# Altium schematic sheet config-bank7.SchDoc: Config FPGA - Bank 7
size Letter; CheckedBy: E. Chiu; CompanyName: Brinton Engineering, LLC; DrawnBy: J. Brinton; Engineer: J. Brinton; Address1: 3479 Edison Way; Address2: Menlo Park CA 94025; Address3: +1 (877) 778-8435; Address4: brintonengineering.com; Revision: 1; SheetNumber: 24; SheetTotal: 71
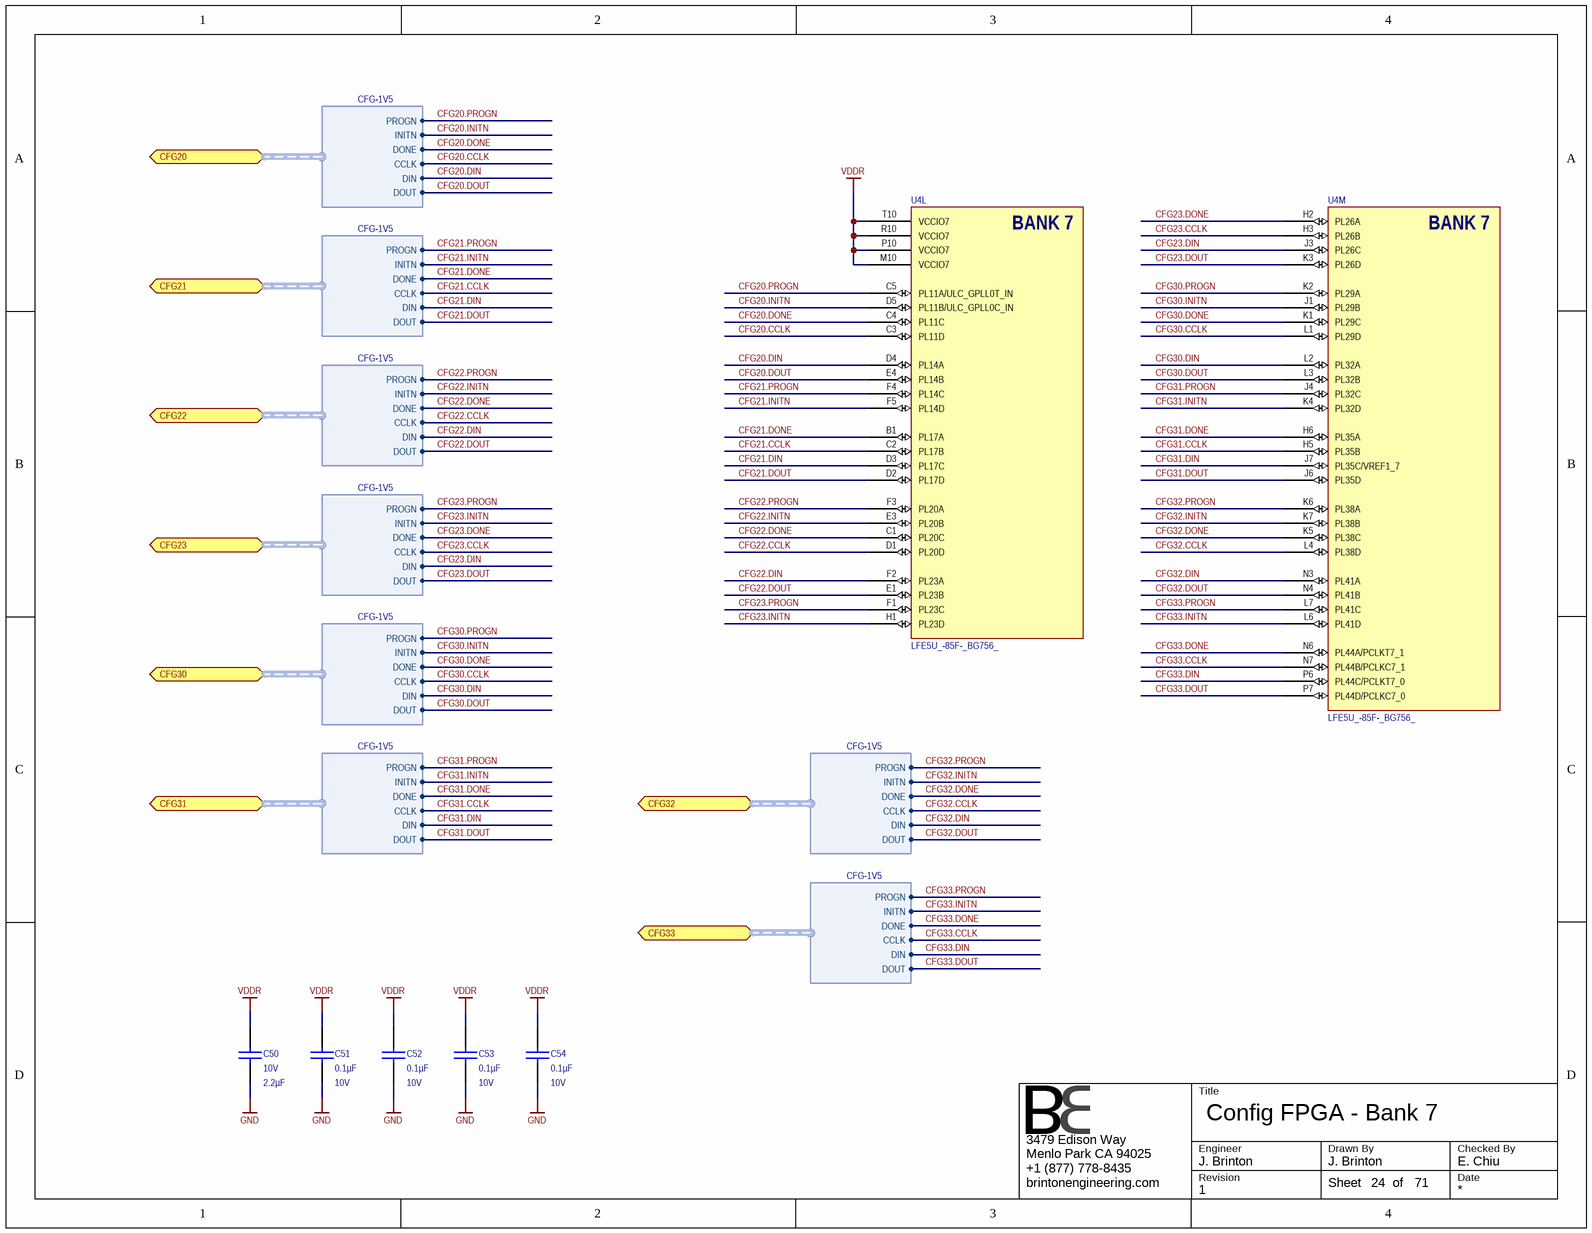
[diagram p0: config-bank7.SchDoc]

## Parts
C50  Voltage - Rated: 10V  Capacitance: 2.2µF  [CAPC1608X90N]  (hidden comment: GRM188R71A225KE15D)
C51  Capacitance: 0.1µF  Voltage - Rated: 10V  [CAPC1005X56N]  (hidden comment: GRM155R71A104KA01J)
C52  Capacitance: 0.1µF  Voltage - Rated: 10V  [CAPC1005X56N]  (hidden comment: GRM155R71A104KA01J)
C53  Capacitance: 0.1µF  Voltage - Rated: 10V  [CAPC1005X56N]  (hidden comment: GRM155R71A104KA01J)
C54  Capacitance: 0.1µF  Voltage - Rated: 10V  [CAPC1005X56N]  (hidden comment: GRM155R71A104KA01J)
U4  LFE5U_-85F-_BG756_  [caBGA756]  (parts L,M of 19)

## Ports
CFG20 (harness CFG-1V5), CFG21 (harness CFG-1V5), CFG22 (harness CFG-1V5), CFG23 (harness CFG-1V5), CFG30 (harness CFG-1V5), CFG31 (harness CFG-1V5), CFG32 (harness CFG-1V5), CFG33 (harness CFG-1V5)

## Harnesses
CFG-1V5: PROGN, INITN, DONE, CCLK, DIN, DOUT

## Nets
GND: C50.1 C51.1 C52.1 C53.1 C54.1
VDDR: C50.2 C51.2 C52.2 C53.2 C54.2 U4.M10(VCCIO7) U4.P10(VCCIO7) U4.R10(VCCIO7) U4.T10(VCCIO7)
CFG20.CCLK: U4.C3(PL11D) ; port CFG20.CCLK
CFG20.DIN: U4.D4(PL14A) ; port CFG20.DIN
CFG20.DONE: U4.C4(PL11C) ; port CFG20.DONE
CFG20.DOUT: U4.E4(PL14B) ; port CFG20.DOUT
CFG20.INITN: U4.D5(PL11B/ULC_GPLL0C_IN) ; port CFG20.INITN
CFG20.PROGN: U4.C5(PL11A/ULC_GPLL0T_IN) ; port CFG20.PROGN
CFG21.CCLK: U4.C2(PL17B) ; port CFG21.CCLK
CFG21.DIN: U4.D3(PL17C) ; port CFG21.DIN
CFG21.DONE: U4.B1(PL17A) ; port CFG21.DONE
CFG21.DOUT: U4.D2(PL17D) ; port CFG21.DOUT
CFG21.INITN: U4.F5(PL14D) ; port CFG21.INITN
CFG21.PROGN: U4.F4(PL14C) ; port CFG21.PROGN
CFG22.CCLK: U4.D1(PL20D) ; port CFG22.CCLK
CFG22.DIN: U4.F2(PL23A) ; port CFG22.DIN
CFG22.DONE: U4.C1(PL20C) ; port CFG22.DONE
CFG22.DOUT: U4.E1(PL23B) ; port CFG22.DOUT
CFG22.INITN: U4.E3(PL20B) ; port CFG22.INITN
CFG22.PROGN: U4.F3(PL20A) ; port CFG22.PROGN
CFG23.CCLK: U4.H3(PL26B) ; port CFG23.CCLK
CFG23.DIN: U4.J3(PL26C) ; port CFG23.DIN
CFG23.DONE: U4.H2(PL26A) ; port CFG23.DONE
CFG23.DOUT: U4.K3(PL26D) ; port CFG23.DOUT
CFG23.INITN: U4.H1(PL23D) ; port CFG23.INITN
CFG23.PROGN: U4.F1(PL23C) ; port CFG23.PROGN
CFG30.CCLK: U4.L1(PL29D) ; port CFG30.CCLK
CFG30.DIN: U4.L2(PL32A) ; port CFG30.DIN
CFG30.DONE: U4.K1(PL29C) ; port CFG30.DONE
CFG30.DOUT: U4.L3(PL32B) ; port CFG30.DOUT
CFG30.INITN: U4.J1(PL29B) ; port CFG30.INITN
CFG30.PROGN: U4.K2(PL29A) ; port CFG30.PROGN
CFG31.CCLK: U4.H5(PL35B) ; port CFG31.CCLK
CFG31.DIN: U4.J7(PL35C/VREF1_7) ; port CFG31.DIN
CFG31.DONE: U4.H6(PL35A) ; port CFG31.DONE
CFG31.DOUT: U4.J6(PL35D) ; port CFG31.DOUT
CFG31.INITN: U4.K4(PL32D) ; port CFG31.INITN
CFG31.PROGN: U4.J4(PL32C) ; port CFG31.PROGN
CFG32.CCLK: U4.L4(PL38D) ; port CFG32.CCLK
CFG32.DIN: U4.N3(PL41A) ; port CFG32.DIN
CFG32.DONE: U4.K5(PL38C) ; port CFG32.DONE
CFG32.DOUT: U4.N4(PL41B) ; port CFG32.DOUT
CFG32.INITN: U4.K7(PL38B) ; port CFG32.INITN
CFG32.PROGN: U4.K6(PL38A) ; port CFG32.PROGN
CFG33.CCLK: U4.N7(PL44B/PCLKC7_1) ; port CFG33.CCLK
CFG33.DIN: U4.P6(PL44C/PCLKT7_0) ; port CFG33.DIN
CFG33.DONE: U4.N6(PL44A/PCLKT7_1) ; port CFG33.DONE
CFG33.DOUT: U4.P7(PL44D/PCLKC7_0) ; port CFG33.DOUT
CFG33.INITN: U4.L6(PL41D) ; port CFG33.INITN
CFG33.PROGN: U4.L7(PL41C) ; port CFG33.PROGN

## Notes on the sheet
- Title
- Engineer
- Revision
- Drawn By
- Checked By
- Date
- Sheet
- of
- (in symbol LFE5U_-85F-_BG756_, part L) BANK 7
- (in symbol LFE5U_-85F-_BG756_, part M) BANK 7

## Library data of the parts
C50 = GRM188R71A225KE15D: CAP CER 2.2UF 10V 10% X7R 0603; Manufacturer: Murata Electronics North America; Manufacturer P/N: GRM188R71A225KE15D; Operating Temperature: -55°C ~ 125°C; Thickness (Max): 0.035" (0.90mm); Tolerance: ±10%; Package / Case: 0603 (1608 Metric); Temperature Coefficient: X7R; Supplier 1: Newark; Supplier 2: Digi-Key; RoHS: RoHS Compliant; Size / Dimension: 0.063" L x 0.031" W (1.60mm x 0.80mm); Mounting Type: Surface Mount, MLCC; ComponentLink1URL: http://www.murata.com/~/media/webrenewal/support/library/catalog/products/capacitor/mlcc/c02e.ashx; ComponentLink1Description: http://www.murata.com/~/media/webrenewal/support/library/catalog/products/capacitor/mlcc/c02e.ashx; Supplier Part Number 1: 72R4209; Supplier Part Number 2: 490-4520-1-ND
C51-C54 = GRM155R71A104KA01J: CAP CER 0.1UF 10V 10% X7R 0402; Manufacturer: Murata Electronics North America; Manufacturer P/N: GRM155R71A104KA01J; Operating Temperature: -55°C ~ 125°C; Thickness (Max): 0.022" (0.55mm); Size / Dimension: 0.039" L x 0.020" W (1.00mm x 0.50mm); RoHS: RoHS Compliant; Mounting Type: Surface Mount, MLCC; Supplier 1: Digi-Key; ComponentLink1URL: http://www.murata.com/~/media/webrenewal/support/library/catalog/products/capacitor/mlcc/c02e.ashx; ComponentLink1Description: http://www.murata.com/~/media/webrenewal/support/library/catalog/products/capacitor/mlcc/c02e.ashx; Supplier Part Number 1: 490-6322-1-ND; Temperature Coefficient: X7R; Package / Case: 0402 (1005 Metric); Tolerance: ±10%
U4 = LFE5U_-85F-_BG756_: ECP5 FPGA, 85k LUT, 756-caBGA; Manufacturer: Lattice Semiconductor; Manufacturer P/N: LFE5U_-85F-_BG756_